# EAGLE design 454_mic102 (EAGLE 9.6.0)
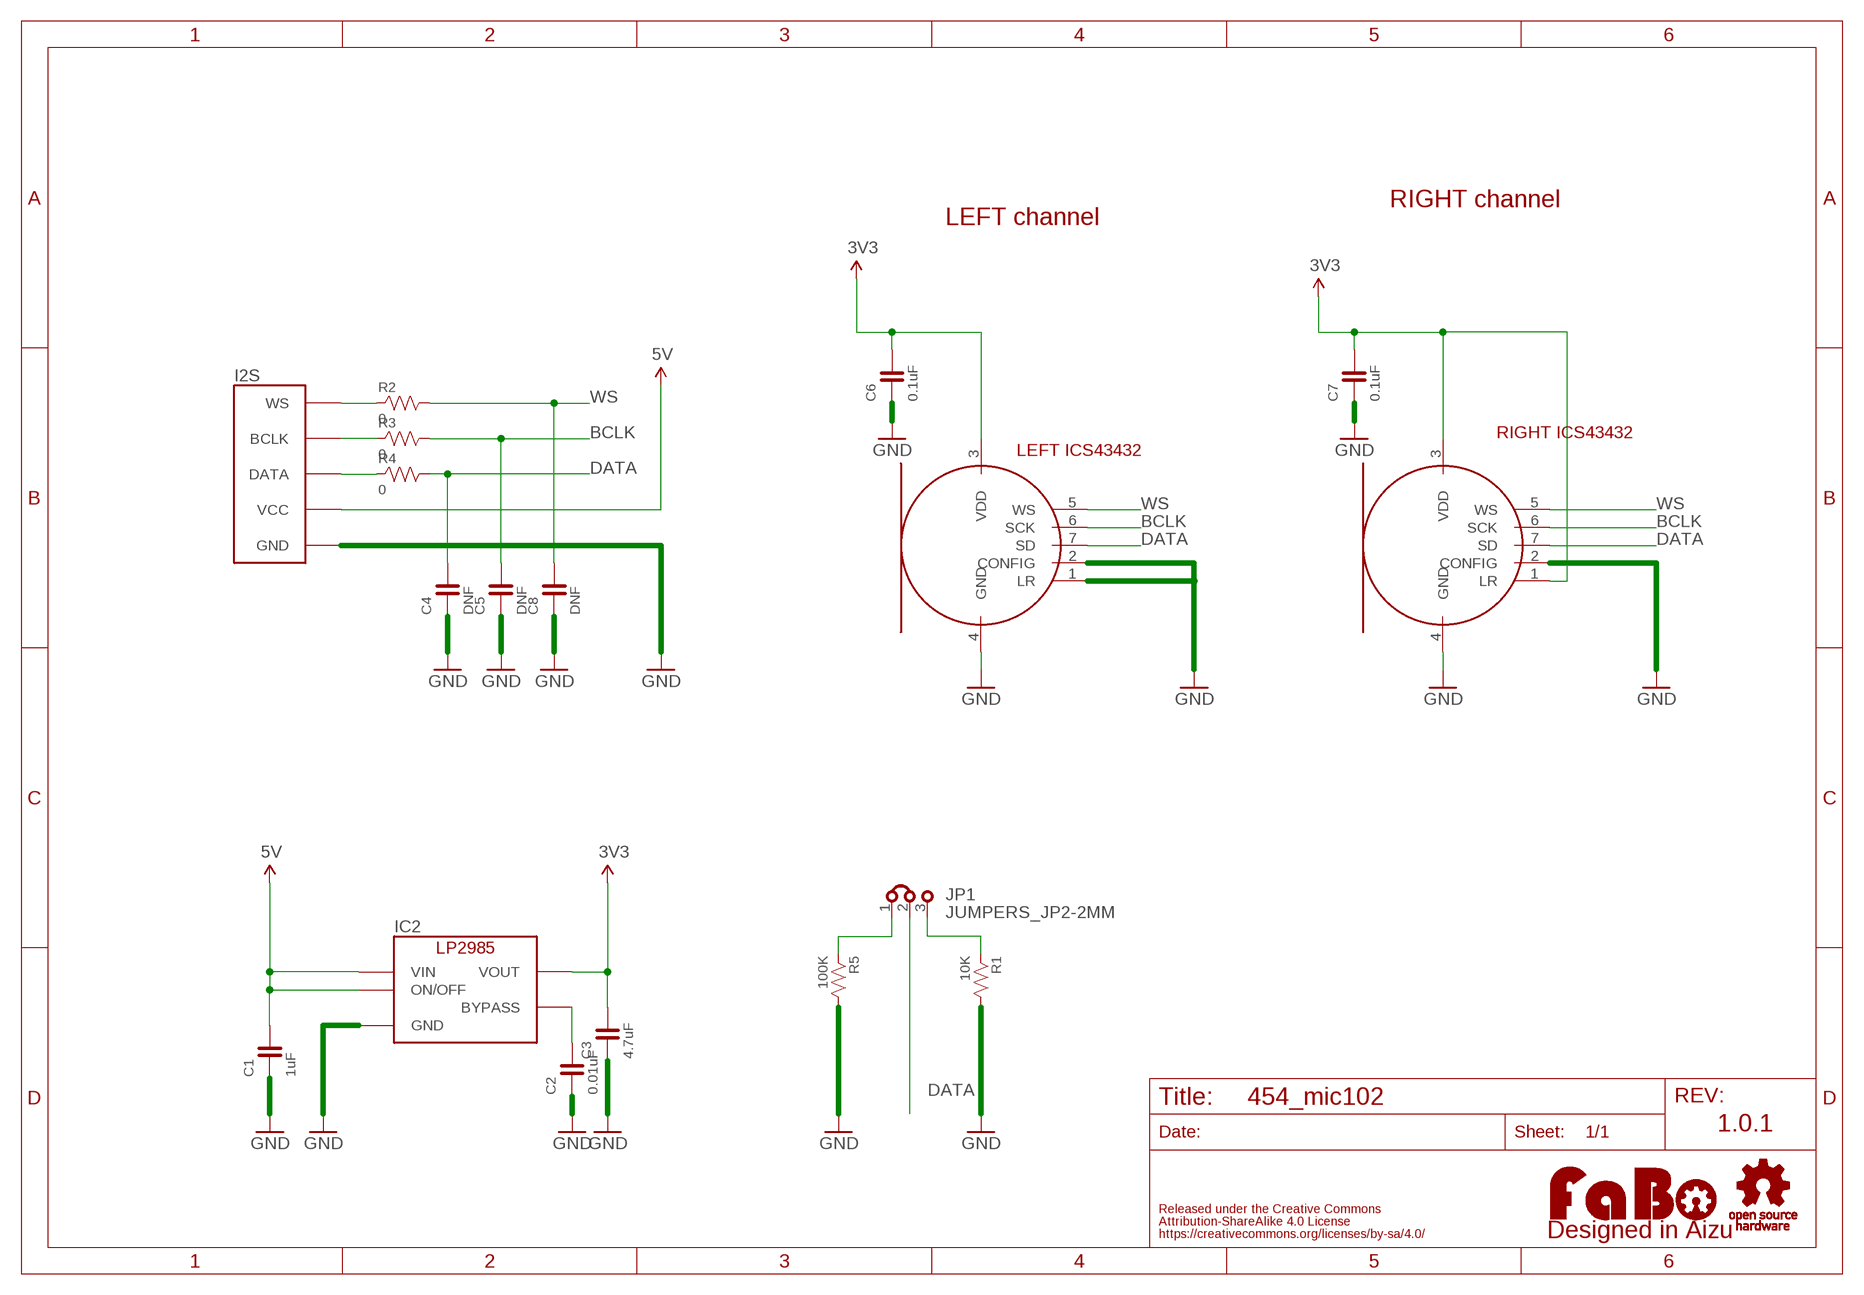
[diagram p0: schematic, sheet 1]

## Parts
C1  1uF  CAPACITOR-0603  [0603]
C2  0.01uF  CAPACITOR-0603  [0603]
C3  4.7uF  CAPACITOR-0603  [0603]
C4  DNF  CAPACITOR-0603  [0603]
C5  DNF  CAPACITOR-0603  [0603]
C6  0.1uF  CAPACITOR-0603  [0603]
C7  0.1uF  CAPACITOR-0603  [0603]
C8  DNF  CAPACITOR-0603  [0603]
I2S  FABO_BRICK_I2STOP  [FABO_BRICK_I2S_B05B-PARK-1]
IC2  LP2985-33DBV  [SOT-23-5]
JP1  JUMPERS_JP2-2MM  [JUMPERS_JP2-2MM]
LOGO1  LOGO_FABO-M_BOTTOM  [LOGO_FABO_M_BOTTOM]
MIC_LEFT  TDK-ICS43432  [TDK-ICS43432]
MIC_RIGHT  TDK-ICS43432  [TDK-ICS43432]
R1  10K  RESISTOR-0603  [0603]
R2  0  RESISTOR-0603  [0603]
R3  0  RESISTOR-0603  [0603]
R4  0  RESISTOR-0603  [0603]
R5  100K  RESISTOR-0603  [0603]
U$2  LOGO_OSHW-M  [LOGO_OSHW_M]

## Nets
3V3: C3.2 C6.2 C7.2 IC2.5(VOUT) MIC_LEFT.3(VDD) MIC_RIGHT.1(LR) MIC_RIGHT.3(VDD)
5V: C1.2 I2S.VCC IC2.1(VIN) IC2.3(ON/OFF)
BCLK: C5.2 MIC_LEFT.6(SCK) MIC_RIGHT.6(SCK) R3.2
DATA: C4.2 JP1.2 MIC_LEFT.7(SD) MIC_RIGHT.7(SD) R4.2
GND: C1.1 C2.1 C3.1 C4.1 C5.1 C6.1 C7.1 C8.1 I2S.GND IC2.2(GND) MIC_LEFT.1(LR) MIC_LEFT.2(CONFIG) MIC_LEFT.4(GND) MIC_RIGHT.2(CONFIG) MIC_RIGHT.4(GND) R1.2 R5.2
N$1: C2.2 IC2.4(BYPASS)
N$2: JP1.1 R5.1
N$3: JP1.3 R1.1
N$4: I2S.WS R2.1
N$5: I2S.BCLK R3.1
N$6: I2S.DATA R4.1
WS: C8.2 MIC_LEFT.5(WS) MIC_RIGHT.5(WS) R2.2

## Notes on the sheet
- RIGHT channel
- LEFT channel
- RIGHT ICS43432
- LEFT ICS43432
- 1.0.1

## Library data of the parts
C1-C8 = FaBo-Capacitor:CAPACITOR: CAPACITOR
I2S = FaBo-Template:FABO_BRICK_I2S
IC2 = FaBo-Supply:LP2985: LP2985
JP1 = 52101-101-REV-A_v16:JUMPERS_JP2-: Jumper/Bridge
LOGO1 = component:LOGO_FABO
MIC_LEFT MIC_RIGHT = FaBo-Mems:TDK-ICS43432
R1-R5 = FaBo-Resistors:RESISTOR: RESISTOR
U$2 = component:LOGO_OSHW

## Board
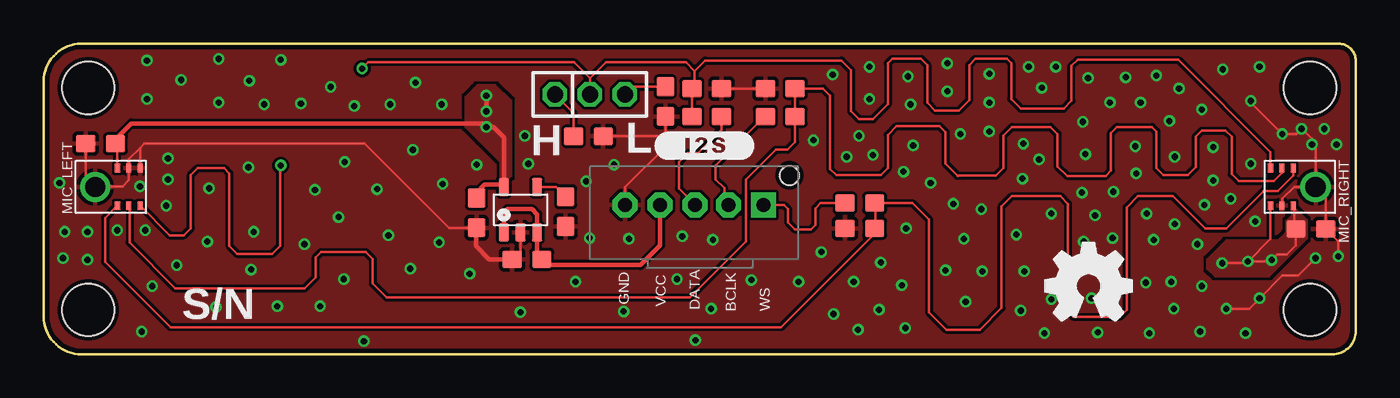
[diagram p1: board, top side]
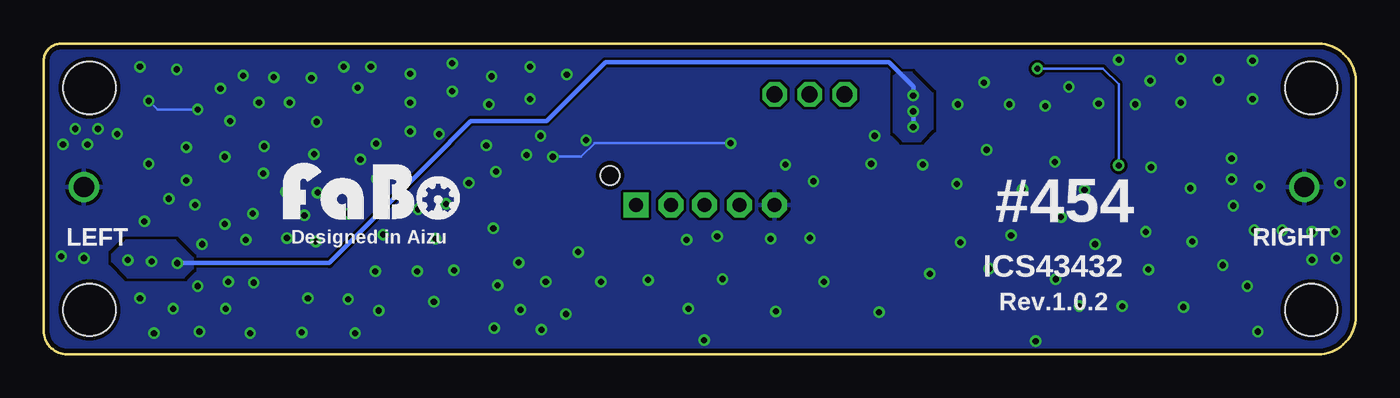
[diagram p2: board, bottom side, seen from below]

Size 75 x 17.77 mm. Coordinates in mm from the lower left corner, seen from the top.
Outline: 0,2.17 0,15.62 arc-90 2.15,17.77 74.01,17.77 arc-90 75,16.78 75,1.34 arc-90 73.66,0 2.17,0 arc-90 0,2.17
Copper layers (1*16): Top 0.035mm / dielectric 1.6mm / Bottom 0.035mm
Design rules "PCBway": minimum track width 6mil, minimum drill 12mil, track to track 6mil, track to pad 6mil, pad to pad 6mil, via to via 6mil, smd to smd 6mil, copper to edge 10mil, drill to drill 10mil, minimum pad ring 10mil, minimum via ring 6mil, stop-mask expansion 2mil, vias tented up to drill 100mil, thermal gap 8mil
Holes 3 mm at 2.54,2.54 2.54,15.24 72.39,15.24 72.39,2.54

### Footprints (pad centres in the part's own frame; a part is rotated, then mirrored left to right if it is on the bottom)
0603 = smd 1.1 x 1: 1 -0.85,0; 2 0.85,0
FABO_BRICK_I2S_B05B-PARK-1 = drill 0.8 pad 1.422 octagon: BCLK 1.635,2.54; DATA -0.27,2.54; GND -4.27,2.54; VCC -2.27,2.54 | drill 0.8 pad 1.422 square: WS 3.635,2.54 | hole 1.1: 5.135,4.24
SOT-23-5 = smd 0.6 x 1.05: 1 -0.95,-1.3; 2 0,-1.3; 3 0.95,-1.3; 4 0.95,1.3; 5 -0.95,1.3
JUMPERS_JP2-2MM = drill 0.914 octagon: 1 -2,0; 2 0,0; 3 2,0
TDK-ICS43432 = smd 0.5 x 0.3: 1 1.075,-2.575; 2 1.075,-1.925; 3 1.075,-1.275; 5 -1.075,-1.275; 6 -1.075,-1.925; 7 -1.075,-2.575 | drill 1.15 pad 1.65: 4 0,0

### Placement (x,y rotation side)
C1  27.61,5.43 0 top
C2  29.84,8.16 90 top
C3  24.74,8.09 90 top
C4  37.9,15.2 180 top
C5  42.1,15.2 0 top
C6  3.25,12.05 0 top
C7  72.44,7.17 180 top
C8  46.65,7.2 0 top
I2S  37.5,6 0 top
IC2  27.25,8.27 0 top
JP1  31.21,14.87 0 top
LOGO1  56.27,7.33 0 top
MIC_LEFT  2.94,9.57 90 top
MIC_RIGHT  72.7,9.57 270 top
R1  35.54,14.46 270 top
R2  46.65,8.65 0 top
R3  42.1,13.6 0 top
R4  37.9,13.6 180 top
R5  31.13,12.47 0 top
U$2  59.74,3.91 0 top

### Tracks (layer width: path | path; a pad name or v marks a point on that pad's centre or on a via)
3V3  (via drill 0.35)
  Top 0.152: MIC_LEFT.3 4.21,11.94 C6.2 | MIC_RIGHT.3 71.48,8.44 71.48,7.27 C7.2 71.58,6.23 71.06,5.71 70.52,5.71 v70.2,5.39 70.12,5.31 v68.85,5.31 | v67.36,5.21 68.74,5.21 v68.84,5.31 v68.85,5.31 | MIC_RIGHT.1 70.12,6.59 v68.85,5.31
  Top 0.254: v25.3,14.8 v25.3,13.9 | C6.2 4.1,12.3 5,13.2 25.1,13.2 v25.3,13 25.7,13 26.3,12.4 26.3,9.7 | IC2.5 26.3,9.7 | C3.2 24.74,9.24 25.2,9.7 26.3,9.7
  Bottom 0.152: v67.35,5.2 v67.36,5.21
  Bottom 0.254: v25.3,13.9 v25.3,13 | v25.3,14.8 25.3,15.3 26.7,16.7 42.9,16.7 46.25,13.35 50.6,13.35 51.8,12.15 51.8,12.1 58.69,5.21 v67.36,5.21
  pour Bottom (no thermals): 25.6,12.2 24.9,12.2 24.2,12.9 24.2,14.9 25.4,16.1 26.2,16.1 26.4,15.9 26.4,12.7 25.9,12.2
  pour Top (no thermals): 24.9,12.2 24.1,13 24.1,13.2 24.1,14.7 24.6,15.2 24.8,15.4 25.8,15.4 26.7,14.5 26.7,10.8 26.7,10.2 26.5,10 26.1,10 26.1,11
  pour Top (no thermals): 66.52,4.89 66.52,5.42 67.35,6.25 67.6,6.51 69.76,6.51 70.56,6.51 70.96,6.91 71.02,6.97 71.02,7.62 71.37,7.97 71.37,8.23 71.5,8.36 71.51,8.36 72.19,7.68 72.19,6.62 70.02,4.45 67.05,4.45 66.96,4.45 66.53,4.88 66.52,4.88 66.51,4.89
  pour Bottom (no thermals): 66.5,4.9 66.5,5.5 67.5,6.5 70.3,6.5 71.1,5.7 71.1,5.3 70.2,4.4 67,4.4
5V
  Top 0.152: 28.2,6.8 IC2.3 | C1.2 28.46,5.5
  Top 0.254: IC2.1 26.3,8.1 26.5,8.3 27.9,8.3 28.2,8 28.2,7.1 28.2,6.8 | 28.2,6.59 28.2,6.8 | I2S.VCC 35.23,6.23 34.1,5.1 28.86,5.1 28.46,5.5 | C1.2 28.2,5.7 28.2,6.8
BCLK
  Top 0.152: MIC_LEFT.6 4.9,8.46 4.9,6.4 7.53,3.77 14.93,3.77 15.55,4.4 15.55,5.55 15.85,5.85 18.4,5.85 18.8,5.45 18.8,4.05 19.6,3.25 36.95,3.25 40.15,6.45 40.15,10 41.85,11.7 42.5,11.7 42.95,12.15 R3.2 | MIC_RIGHT.6 70.78,10.38 70.3,9.9 68.3,9.9 67.9,10.3 67.9,12.45 67.56,12.79 66.19,12.79 65.85,12.45 65.85,10.7 65.4,10.25 64,10.25 63.6,10.65 63.6,12.75 63.35,13 61.35,13 61,12.65 61,10.5 60.7,10.2 58.5,10.2 57.95,10.75 57.95,12.6 57.55,13 55.35,13 54.85,12.5 54.85,10.65 54.42,10.22 52.23,10.22 | C5.2 42.9,15.2 42.9,15.1 42.56,15.1 | R3.2 42.9,13.65 | C5.2 44.55,15.2 44.95,14.8 44.95,10.6 45.3,10.25 47.85,10.25 48.25,10.65 48.25,12.55 48.75,13.05 51.2,13.05 51.55,12.7 51.55,10.9 52.23,10.22 | 52.23,10.22 52.25,10.2 | C5.2 R3.2
DATA  (via drill 0.35)
  Top 0.152: MIC_LEFT.7 7.21,6.8 8,6.8 8.4,7.2 8.4,10.25 8.8,10.65 10.3,10.65 10.6,10.35 10.6,6.2 11.05,5.75 13.05,5.75 13.5,6.2 13.5,10.75 v13.55,10.8 | R4.2 C4.2 37.2,15.35 37.2,16.05 37.2,16.2 | JP1.2 31.21,15.79 | 31.21,15.79 30.3,16.7 18.56,16.7 v18.2,16.34 | 31.21,15.79 32.13,16.7 36.7,16.7 37.2,16.2 | MIC_RIGHT.7 70.12,11.57 64.85,16.85 59.1,16.85 58.75,16.5 58.75,14.5 58.3,14.05 55.85,14.05 55.3,14.6 55.3,16.65 55.05,16.9 53.25,16.9 52.9,16.55 52.9,14.55 52.3,13.95 50.95,13.95 50.5,14.4 50.5,16.55 50.15,16.9 48.5,16.9 48.25,16.65 48.25,14.3 47.4,13.45 46.6,13.45 46.15,13.9 46.15,16.25 45.6,16.8 37.8,16.8 37.2,16.2
  Bottom 0.152: v13.55,10.8 13.55,15.44 14.45,16.34 v18.2,16.34
GND  (via drill 0.35)
  Top 0.152: IC2.2 27.25,5.92 C1.1 26.73,5.4 | 32.53,12.47 R5.2 35.33,12.47 v35.73,12.07 | R1.2 35.54,12.28 v35.74,12.08 v35.73,12.07 | C3.1 23.16,7.24 18.35,12.05 5.75,12.05 5.51,11.81 | C6.1 2.4,10.11 MIC_LEFT.4 2.96,9.6 4.5,9.6 4.86,9.96 MIC_LEFT.2 4.86,11.16 5.51,11.81 | MIC_LEFT.1 5.51,11.81 | MIC_RIGHT.4 73.28,8.99 C7.1 74,6.46 v74,5.6 | MIC_RIGHT.2 70.8,8.53 70.8,8.9 71.47,9.57 MIC_RIGHT.4 | 38.85,15.3 C4.1 C5.1 | v35.73,12.07 33.23,9.57 I2S.GND | v72.7,5.5 71.7,4.5 70.8,4.5 v69.5,3.2 68.9,2.6 v67.6,2.6 | MIC_RIGHT.4 72.7,11.8 v72.5,12 72.5,12.3 v71.9,12.9 71.6,12.6 v70.8,12.6 69,14.4 v69,14.5
  Top 0.254: C1.1 25.47,5.43 24.7,6.2 24.7,7.2 C3.1
  Bottom 0.152: 43.52,12.08 43.5,12.08 | 43.5,12.08 v35.74,12.08 | v45.9,11.3 44.28,11.3 43.5,12.08 | v69,14.5 68.5,14 v66.2,14
  other vias: 69,10.9 64.9,15.2 27.7,10.9 31,9.9 32.6,10.85 5.8,7.1 4.2,7.1 7,8.5 27.5,12.5 67.4,16.3 73.9,12 2.5,7 1.2,7 1.1,5.5 2.5,5.4 7.1,11.2 5.9,14.6 5.9,16.8 10,16.9 19.8,14.3 10,14.4 21.1,11.7 17.2,11 11.7,10.7 5.6,1.3 7.1,10 5.5,9.6 0.9,9.8 73.2,12.9 68.7,1.2 63.2,1.2 57.2,1.2 66.1,1.3 66.2,3.9 7.6,5.1 6.2,3.9 64.6,2.6 14.7,14.35 13.55,16.85 7.85,15.7 11.75,15.65 9.45,9.5 12,7 9.35,6.45 15.5,9.4 19.05,9.45 16.85,7.85 14.9,6.3 11.85,4.85 9.85,2.7 13.35,2.75 17.15,4.3 18.3,0.75 19.7,6.8 22.6,6.4 20.95,4.9 24.35,4.6 22.8,9.75 24.75,10.85 22.75,14.3 12.6,14.3 16.4,15.3 17.75,14.2 21.25,15.55 47.2,14.6 45.1,16 47.4,11.4 46.6,12.5 49.4,15.9 49.55,14.3 49.7,11.95 49.15,10.45 50.7,9.8 49.3,7.2 44.45,5.85 47.85,5.25 52.7,3 51.55,4.8 53.65,4.75 52.6,6.6 53.6,8.3 52,8.6 56,12.05 56.9,11.15 55.95,10.05 52.4,12.6 54.05,12.75 54.05,16.05 54.05,14.4 51.65,15.05 56.3,16.45 57.85,16.45 57.05,15.25 59.4,13.3 59.7,15.8 62.7,14.4 59.55,11.45 62.4,11.9 62.45,10.35 66.85,11.85 64.65,11.3 64.35,13.35 66.85,9.95 67.85,8.9 66.35,8.55 59.9,3.2 59.45,6.45 61.1,6.65 60.1,7.95 59.35,9.25 61.15,9.3 69.25,7.6 65.95,6.3 64.65,7.45 63.05,8.05 63.45,6.55 63,4.1 64.45,4.15 60.25,1.25 55.85,2.5 57.6,3.15 56.05,4.75 55.6,6.85 57.6,8.05 47.2,16.45 51.65,16.65 60.95,14.4 61.85,15.85 63.6,15.95 69.5,16.45 46.3,4.15 49.05,3.95 49.25,1.5 47.75,2.55 45.15,2.3 46.55,1.4 43.15,4.15 40.45,4.25 38.15,2.6 30.4,4.15 36.2,4.3 36.5,6.75 38.25,6.55 31.2,6.65 33.45,6.6 27.25,2.4 33.15,2.45 37.25,0.8 15.8,2.75 44,12.25
  pour Top (rank 6): 0,0 74.93,0 74.93,17.78 0,17.78
  pour Bottom (rank 6): -0.9,0 74.93,0 74.93,17.78 -0.9,17.78
N$1
  Top 0.152: C2.2 29.28,9.57 IC2.4
N$2
  Top 0.152: JP1.1 30.28,13.8 R5.1
N$3
  Top 0.152: JP1.3 33.66,15.31 R1.1
N$4
  Top 0.152: 45.98,8.84 R2.1 44.4,8.65 44.1,8.35 44.1,7.4 43.85,7.15 42.95,7.15 42.55,7.55 42.55,8.3 42.31,8.54 I2S.WS
N$5
  Top 0.152: R3.1 41.25,13.5 | 41.25,13.5 41.25,13.25 | I2S.BCLK 38.9,8.78 38.9,9.5 38.4,10 38.4,10.8 41.1,13.5 41.25,13.5
N$6
  Top 0.152: 38.75,13.75 R4.1 | 38.45,13.3 R4.1 | R4.1 38.75,12.85 37.4,11.5 36.8,11.5 36.3,11 36.3,9.47 I2S.DATA
WS
  Top 0.152: MIC_RIGHT.5 71.42,10.22 70.55,9.35 69.75,9.35 67.6,7.2 66.4,7.2 64.55,9.05 62.55,9.05 61.9,8.4 61.9,2.55 61.5,2.15 58.85,2.15 58.55,2.45 58.55,8.6 58.1,9.05 55.35,9.05 54.75,8.45 54.75,2.65 53.5,1.4 51.6,1.4 50.6,2.4 50.6,7.7 49.65,8.65 R2.2 | R2.2 47.45,8.7 | 47.75,6.95 47.55,7.15 | 47.55,7.15 C8.2 47.5,6.9 42.15,1.55 7.25,1.55 3.51,5.29 3.51,7.8 MIC_LEFT.5 | 48.05,8.65 R2.2 | R2.2 47.55,8.6 47.55,7.15

### Text on the board
tPlace: L | H | GND | VCC | DATA | S/N | BCLK | WS
bPlace: #454 | Designed in Aizu | RIGHT | LEFT | ICS43432 | Rev.1.0.2